# EAGLE design RAMPS_1.4.2.3 (EAGLE 7.5.0)
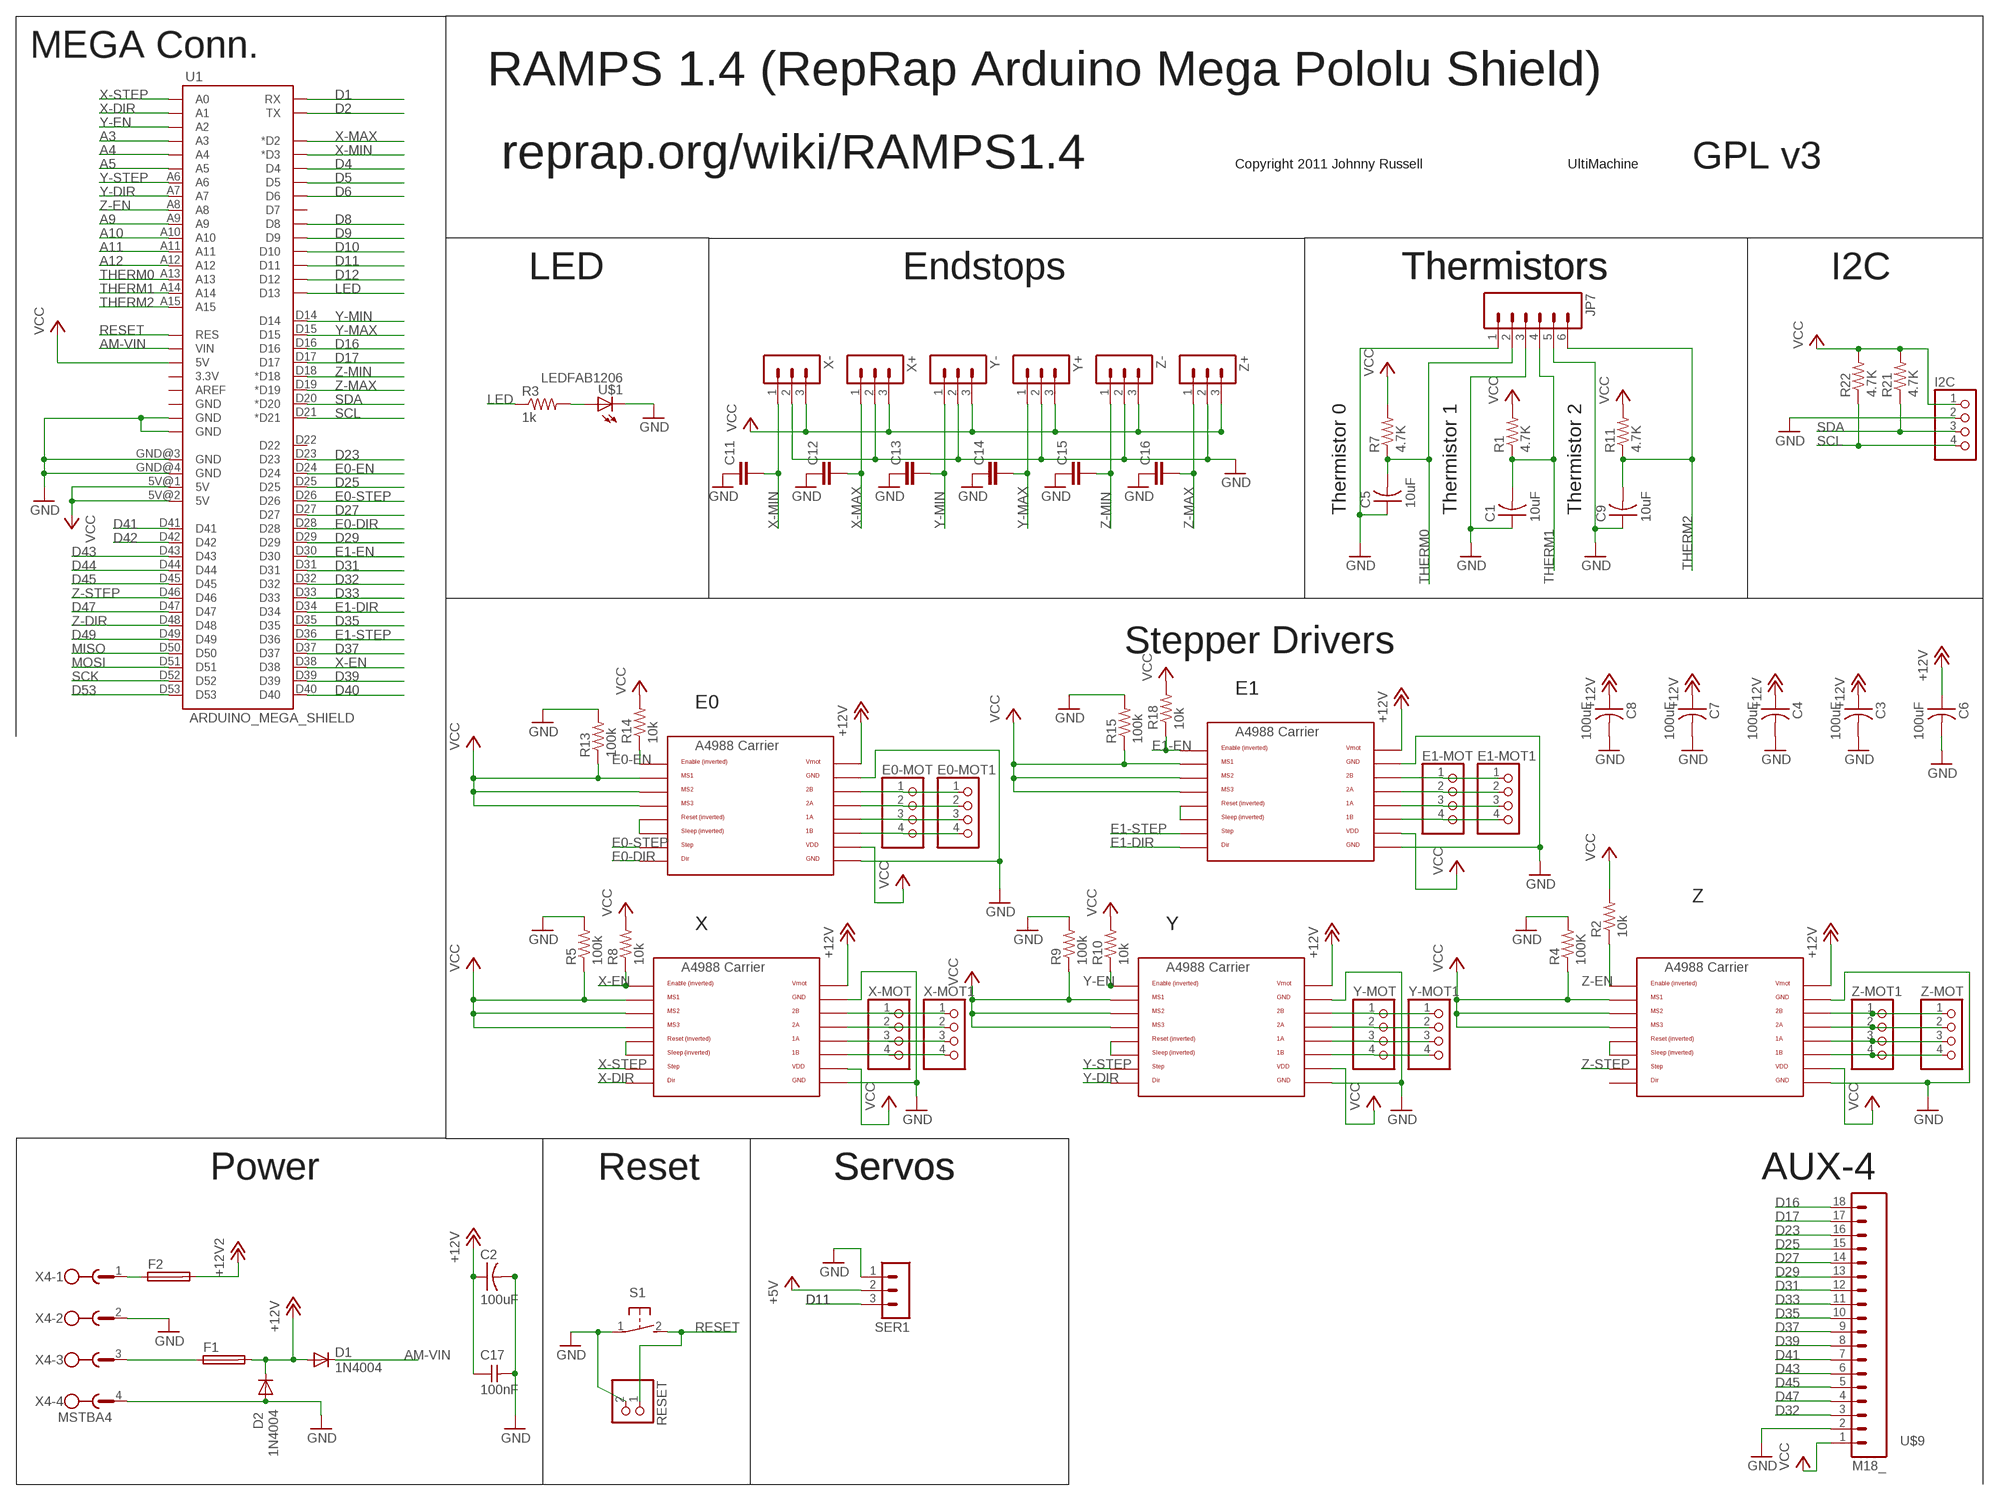
[diagram p0: schematic, sheet 1]

## Parts
C1  10uF  CAP-US1206FAB  [C1206FAB]
C2  100uF  CAP-US1206FAB  [C1206FAB]
C3  100uF  CAP-US1206FAB  [C1206FAB]
C4  100uF  CAP-US1206FAB  [C1206FAB]
C5  10uF  CAP-US1206FAB  [C1206FAB]
C6  100uF  CAP-US1206FAB  [C1206FAB]
C7  100uF  CAP-US1206FAB  [C1206FAB]
C8  100uF  CAP-US1206FAB  [C1206FAB]
C9  10uF  CAP-US1206FAB  [C1206FAB]
C11  C-EUC0805  [C0805]
C12  C-EUC0805  [C0805]
C13  C-EUC0805  [C0805]
C14  C-EUC0805  [C0805]
C15  C-EUC0805  [C0805]
C16  C-EUC0805  [C0805]
C17  100nF  CAP-UNPOLARIZEDFAB  [C1206FAB]
D1  1N4004  [DO41-10]
D2  1N4004  [DO41-10]
E0-MOT  PINHD-1X4  [1X04]
E0-MOT1  PINHD-1X4  [1X04]
E1-MOT  PINHD-1X4  [1X04]
E1-MOT1  PINHD-1X4  [1X04]
F1  FUSE_MCCQ-122  [FUSE_MCCQ-122]
F2  FUSE_MCCQ-122  [FUSE_MCCQ-122]
I2C  PINHD-1X4  [1X04]
JP7  M06SIP  [1X06]
R1  4.7K  R-US_R0805  [R0805]
R2  10k  RES-US1206FAB  [R1206FAB]
R3  1k  RES-US1206FAB  [R1206FAB]
R4  100K  RES-US1206FAB  [R1206FAB]
R5  100k  RES-US1206FAB  [R1206FAB]
R7  4.7K  R-US_R0805  [R0805]
R8  10k  RES-US1206FAB  [R1206FAB]
R9  100k  RES-US1206FAB  [R1206FAB]
R10  10k  RES-US1206FAB  [R1206FAB]
R11  4.7K  R-US_R0805  [R0805]
R13  100k  RES-US1206FAB  [R1206FAB]
R14  10k  RES-US1206FAB  [R1206FAB]
R15  100k  RES-US1206FAB  [R1206FAB]
R18  10k  RES-US1206FAB  [R1206FAB]
R21  4.7K  R-US_R0805  [R0805]
R22  4.7K  R-US_R0805  [R0805]
RESET  PINHD-2  [PINHD-2]
S1  31-XX  [B3F-31XX]
SER1  3PIN-HEADER  [3PIN-HEADER]
U1  ARDUINO_MEGA_SHIELD  [ARDUINO_MEGA_SHIELD]
U$1  LEDFAB1206  [LED1206FAB]
U$4  A4988BREAKOUT  [A4988BREAKOUT]
U$5  A4988BREAKOUT  [A4988BREAKOUT]
U$6  A4988BREAKOUT  [A4988BREAKOUT]
U$7  A4988BREAKOUT  [A4988BREAKOUT]
U$8  A4988BREAKOUT  [A4988BREAKOUT]
U$9  M18_  [1X18]
X4  MSTBA4  [MSTBA4]
X+  3PIN-HEADER  [3PIN-HEADER]
X-  3PIN-HEADER  [3PIN-HEADER]
X-MOT  PINHD-1X4  [1X04]
X-MOT1  PINHD-1X4  [1X04]
Y+  3PIN-HEADER  [3PIN-HEADER]
Y-  3PIN-HEADER  [3PIN-HEADER]
Y-MOT  PINHD-1X4  [1X04]
Y-MOT1  PINHD-1X4  [1X04]
Z+  3PIN-HEADER  [3PIN-HEADER]
Z-  3PIN-HEADER  [3PIN-HEADER]
Z-MOT  PINHD-1X4  [1X04]
Z-MOT1  PINHD-1X4  [1X04]

## Nets
+5V: SER1.2
+12V: C2.1 C3.1 C4.1 C6.1 C7.1 C8.1 C17.1 D1.A D2.C F1.2-1 F1.2-2 U$4.VMOT U$5.VMOT U$6.VMOT U$7.VMOT U$8.VMOT
+12V2: F2.2-1 F2.2-2
A3: U1.A3
A4: U1.A4
A5: U1.A5
A9: U1.A9
A10: U1.A10
A11: U1.A11
A12: U1.A12
AM-VIN: D1.C U1.VIN
D1: U1.RX
D2: U1.TX
D4: U1.D4
D5: U1.D5
D6: U1.D6
D8: U1.D8
D9: U1.D9
D10: U1.D10
D11: SER1.3 U1.D11
D12: U1.D12
D16: U1.D16 U$9.18
D17: U1.D17 U$9.17
D23: U1.D23 U$9.16
D25: U1.D25 U$9.15
D27: U1.D27 U$9.14
D29: U1.D29 U$9.13
D31: U1.D31 U$9.12
D32: U1.D32 U$9.3
D33: U1.D33 U$9.11
D35: U1.D35 U$9.10
D37: U1.D37 U$9.9
D39: U1.D39 U$9.8
D40: U1.D40
D41: U1.D41 U$9.7
D42: U1.D42
D43: U1.D43 U$9.6
D44: U1.D44
D45: U1.D45 U$9.5
D47: U1.D47 U$9.4
D49: U1.D49
D53: U1.D53
E0-DIR: U1.D28 U$4.DIR
E0-EN: R14.1 U1.D24 U$4.EN
E0-STEP: U1.D26 U$4.STEP
E1-DIR: U1.D34 U$5.DIR
E1-EN: R18.1 U1.D30 U$5.EN
E1-STEP: U1.D36 U$5.STEP
GND: C1.1 C2.2 C3.2 C4.2 C5.1 C6.2 C7.2 C8.2 C9.1 C11.1 C12.1 C13.1 C14.1 C15.1 C16.1 C17.2 D2.A I2C.2 JP7.1 JP7.3 JP7.5 R4.2 R5.2 R9.2 R13.2 R15.2 RESET.2 S1.1(P) SER1.1 U1.GND@0(GND) U1.GND@1(GND) U1.GND@3(GND) U1.GND@4(GND) U$1.2(C) U$4.GND U$4.GND@0(GND) U$5.GND U$5.GND@0(GND) U$6.GND U$6.GND@0(GND) U$7.GND U$7.GND@0(GND) U$8.GND U$8.GND@0(GND) U$9.2 X4.2 X4.4 X+.2 X-.2 Y+.2 Y-.2 Z+.2 Z-.2
LED: R3.1 U1.D13
MISO: U1.D50
MOSI: U1.D51
N$3: E0-MOT1.1 E0-MOT.1 U$4.2B
N$4: E0-MOT1.2 E0-MOT.2 U$4.2A
N$8: U$4.RST U$4.SLP(SLEEP)
N$10: E0-MOT1.3 E0-MOT.3 U$4.1A
N$11: E0-MOT1.4 E0-MOT.4 U$4.1B
N$12: E1-MOT1.1 E1-MOT.1 U$5.2B
N$13: E1-MOT1.2 E1-MOT.2 U$5.2A
N$16: E1-MOT1.3 E1-MOT.3 U$5.1A
N$18: E1-MOT1.4 E1-MOT.4 U$5.1B
N$20: U$6.RST U$6.SLP(SLEEP)
N$21: U$6.2B X-MOT1.1 X-MOT.1
N$22: U$6.2A X-MOT1.2 X-MOT.2
N$23: U$7.RST U$7.SLP(SLEEP)
N$24: U$5.RST U$5.SLP(SLEEP)
N$26: U$6.1A X-MOT1.3 X-MOT.3
N$27: U$6.1B X-MOT1.4 X-MOT.4
N$28: U$7.2B Y-MOT1.1 Y-MOT.1
N$29: U$7.2A Y-MOT1.2 Y-MOT.2
N$30: U$7.1A Y-MOT1.3 Y-MOT.3
N$36: U$7.1B Y-MOT1.4 Y-MOT.4
N$38: U$8.RST U$8.SLP(SLEEP)
N$41: U$8.2B Z-MOT1.1 Z-MOT.1
N$42: U$8.2A Z-MOT1.2 Z-MOT.2
N$43: U$8.1A Z-MOT1.3 Z-MOT.3
N$44: U$8.1B Z-MOT1.4 Z-MOT.4
N$46: R3.2 U$1.1(A)
N$53: F2.1-1 F2.1-2 X4.1
N$54: F1.1-1 F1.1-2 X4.3
RESET: RESET.1 S1.2(S) U1.RES
SCK: U1.D52
SCL: I2C.4 R22.1 U1.D21(*D21)
SDA: I2C.3 R21.1 U1.D20(*D20)
THERM0: C5.2 JP7.2 R7.1 U1.A13
THERM1: C1.2 JP7.4 R1.1 U1.A14
THERM2: C9.2 JP7.6 R11.1 U1.A15
VCC: I2C.1 R1.2 R2.2 R4.1 R5.1 R7.2 R8.2 R9.1 R10.2 R11.2 R13.1 R14.2 R15.1 R18.2 R21.2 R22.2 U1.5V@0(5V) U1.5V@1(5V) U1.5V@2(5V) U$4.MS1 U$4.MS2 U$4.MS3 U$4.VDD U$5.MS1 U$5.MS2 U$5.MS3 U$5.VDD U$6.MS1 U$6.MS2 U$6.MS3 U$6.VDD U$7.MS1 U$7.MS2 U$7.MS3 U$7.VDD U$8.MS1 U$8.MS2 U$8.MS3 U$8.VDD U$9.1 X+.3 X-.3 Y+.3 Y-.3 Z+.3 Z-.3
X-DIR: U1.A1 U$6.DIR
X-EN: R8.1 U1.D38 U$6.EN
X-MAX: C12.2 U1.D2(*D2) X+.1
X-MIN: C11.2 U1.D3(*D3) X-.1
X-STEP: U1.A0 U$6.STEP
Y-DIR: U1.A7 U$7.DIR
Y-EN: R10.1 U1.A2 U$7.EN
Y-MAX: C14.2 U1.D15 Y+.1
Y-MIN: C13.2 U1.D14 Y-.1
Y-STEP: U1.A6 U$7.STEP
Z-DIR: U1.D48
Z-EN: R2.1 U1.A8 U$8.EN
Z-MAX: C16.2 U1.D19(*D19) Z+.1
Z-MIN: C15.2 U1.D18(*D18) Z-.1
Z-STEP: U1.D46 U$8.STEP
Unconnected: U1.3.3V U1.AREF U1.D7 U1.D22 U1.GND@2(GND) U$8.DIR

## Notes on the sheet
- MEGA Conn.
- RAMPS 1.4 (RepRap Arduino Mega Pololu Shield)
- reprap.org/wiki/RAMPS1.4 | Copyright 2011 Johnny Russell | UltiMachine | GPL v3
- LED | Endstops | Thermistors | Thermistors | I2C
- Thermistor 0 | Thermistor 1 | Thermistor 2
- Stepper Drivers
- E1
- E0
- Z
- X | Y
- Power | Reset | Servos | Servos | AUX-4

## Library data of the parts
C1-C9 = fab:CAP-US
C11-C16 = rcl:C-EU: CAPACITOR, European symbol
C17 = fab:CAP-UNPOLARIZED
D1 D2 = diode:1N4004: DIODE general purpose rectifier, 1 A
E0-MOT E0-MOT1 E1-MOT E1-MOT1 I2C X-MOT X-MOT1 Y-MOT Y-MOT1 Z-MOT Z-MOT1 = RepRapjr:PINHD-1X4: PIN HEADER
F1 F2 = myLib:FUSE_MCCQ-122
JP7 = SparkFun:M06: Header 6 Standard 6-pin 0.1" header. Use with straight break away headers (SKU : PRT-00116), right angle break away headers (PRT-00553), swiss pins (PRT-00743), machine pins (PRT-00117), and female headers (PRT-00115). Molex polarized connector foot print use with SKU : PRT-08094 with associated crimp pins and housings. NOTES ON THE VARIANTS LOCK and LOCK_LONGPADS... This footprint was designed to help hold the alignment of a through-hole component (i.e. 6-pin header) while soldering it into place. You may notice that each hole has been shifted either up or down by 0.005 of an inch from it's more standard position (which is a perfectly straight line). This slight alteration caused the pins (the squares in the middle) to touch the edges of the holes. Because they are alternating, it causes a "brace" to hold the component in place. 0.005 has proven to be the perfect amount of "off-center" position when using our standard breakaway headers. Although looks a little odd when you look at the bare footprint, once you have a header in there, the alteration is very hard to notice. Also, if you push a header all the way into place, it is covered up entirely on the bottom side. This idea of altering the position of holes to aid alignment will be further integrated into the Sparkfun Library for other footprints. It can help hold any component with 3 or more connection pins.
R1 R7 R11 R21 R22 = adafruit:R-US_: RESISTOR, American symbol
R2-R5 R8-R10 R13-R15 R18 = fab:RES-US: Resistor (US Symbol) Variants with postfix FAB are widened to allow the routing of internal traces
RESET = myLib:PINHD-2
S1 = switch-omron:31-XX: OMRON SWITCH; MPN: B3F-3100; OC_FARNELL: 959704; OC_NEWARK: 36M3582
SER1 X+ X- Y+ Y- Z+ Z- = ultimachine:3PIN-HEADER: PIN HEADER
U1 = RepRapjr:ARDUINO_MEGA_SHIELD
U$1 = fab:LED: LED
U$4-U$8 = RepRapjr:A4988BREAKOUT
U$9 = SparkFun:M18
X4 = con-phoenix-508:MSTBA4: PHOENIX

## Board
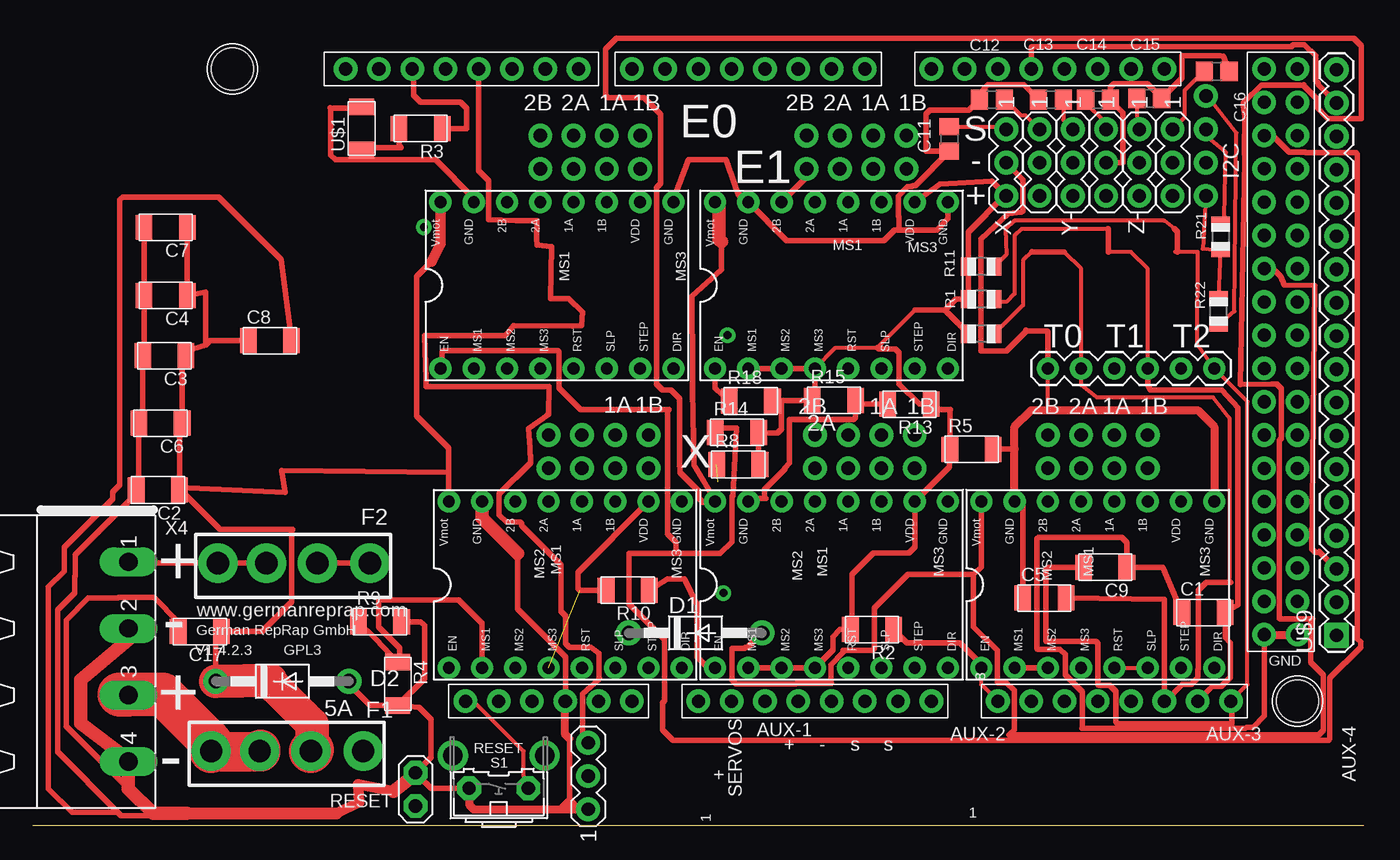
[diagram p1: board, top side]
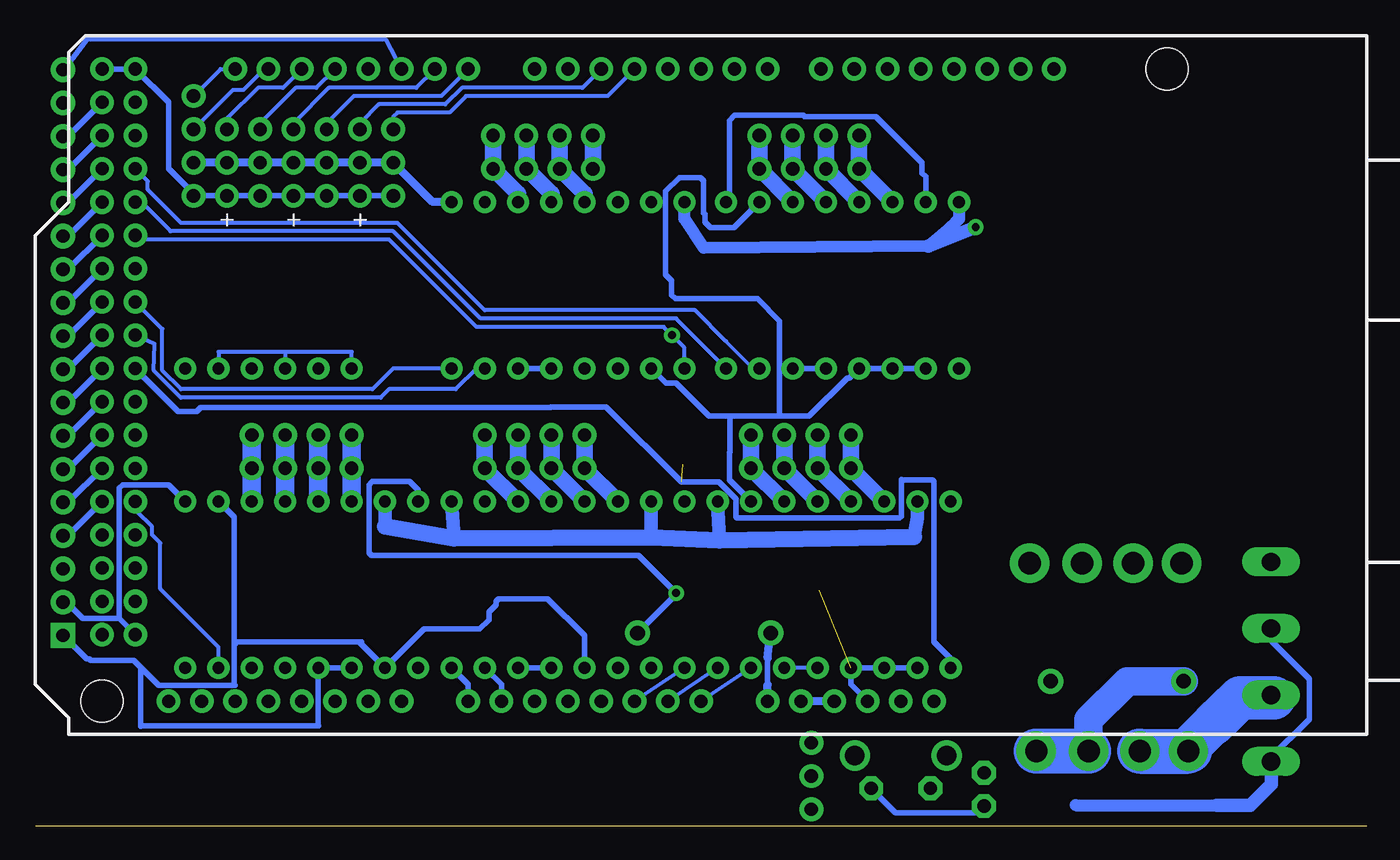
[diagram p2: board, bottom side, seen from below]

Size 101.59 x 0 mm. Coordinates in mm from the lower left corner, seen from the top.
Outline: 101.59,0 0,0
Copper layers (1*16): Top 0.035mm / dielectric 1.6mm / Bottom 0.035mm
Design rules "PCB-CART *": minimum track width 0.2mm, minimum drill 0.4mm, track to track 0.3mm, track to pad 0.3mm, pad to pad 0.2mm, via to via 0.2mm, smd to smd 0.2mm, copper to edge 0.2mm, drill to drill 0.2mm, minimum pad ring 0.4mm, minimum via ring 0.3mm, stop-mask expansion 3mil, vias tented up to drill 0.5mm, thermal gap 12mil

### Footprints (pad centres in the part's own frame; a part is rotated, then mirrored left to right if it is on the bottom)
C1206FAB = smd 1.27 x 1.905: 1 -1.651,0; 2 1.651,0
C0805 = smd 1.3 x 1.5: 1 -0.95,0; 2 0.95,0
DO41-10 = drill 1.118: A 5.08,0; C -5.08,0
1X04 = drill 1.016: 1 -2.54,0; 2 0,0; 3 2.54,0; 4 5.08,0
FUSE_MCCQ-122 = drill 1.7 pad 3: 1-1 -6.7,0; 1-2 -3,0; 2-1 4.9,0; 2-2 0.9,0
1X06 = drill 0.9 pad 1.422: 1 0,0; 2 2.54,0; 3 5.08,0; 4 7.62,0; 5 10.16,0; 6 12.7,0
R0805 = smd 1.1 x 1.4: 1 -1,0; 2 1,0
R1206FAB = smd 1.27 x 1.905: 1 -1.651,0; 2 1.651,0
PINHD-2 = drill 1.016 octagon: 1 -1.27,0; 2 1.27,0
B3F-31XX = drill 1.016 octagon: 1 -2.261,-1.245; 2 2.261,-1.245 | drill 1.499 pad 2.159: 3 -3.505,1.245; 4 3.505,1.245
3PIN-HEADER = drill 1.016: 1 -2.54,0; 2 0,0; 3 2.54,0
ARDUINO_MEGA_SHIELD = drill 1 pad 1.422: 3.3V 35.56,2.54; 5V@0 38.1,2.54; 5V@1 93.98,50.8; 5V@2 96.52,50.8; A0 50.8,2.54; A1 53.34,2.54; A2 55.88,2.54; A3 58.42,2.54; A4 60.96,2.54; A5 63.5,2.54; A6 66.04,2.54; A7 68.58,2.54; A8 73.66,2.54; A9 76.2,2.54; A10 78.74,2.54; A11 81.28,2.54; A12 83.82,2.54; A13 86.36,2.54; A14 88.9,2.54; A15 91.44,2.54; AREF 23.876,50.8; D2 58.42,50.8; D3 55.88,50.8; D4 53.34,50.8; D5 50.8,50.8; D6 48.26,50.8; D7 45.72,50.8; D8 41.656,50.8; D9 39.116,50.8; D10 36.576,50.8; D11 34.036,50.8; D12 31.496,50.8; D13 28.956,50.8; D14 68.58,50.8; D15 71.12,50.8; D16 73.66,50.8; D17 76.2,50.8; D18 78.74,50.8; D19 81.28,50.8; D20 83.82,50.8; D21 86.36,50.8; D22 93.98,48.26; D23 96.52,48.26; D24 93.98,45.72; D25 96.52,45.72; D26 93.98,43.18; D27 96.52,43.18; D28 93.98,40.64; D29 96.52,40.64; D30 93.98,38.1; D31 96.52,38.1; D32 93.98,35.56; D33 96.52,35.56; D34 93.98,33.02; D35 96.52,33.02; D36 93.98,30.48; D37 96.52,30.48; D38 93.98,27.94; D39 96.52,27.94; D40 93.98,25.4; D41 96.52,25.4; D42 93.98,22.86; D43 96.52,22.86; D44 93.98,20.32; D45 96.52,20.32; D46 93.98,17.78; D47 96.52,17.78; D48 93.98,15.24; D49 96.52,15.24; D50 93.98,12.7; D51 96.52,12.7; D52 93.98,10.16; D53 96.52,10.16; GND@0 40.64,2.54; GND@1 43.18,2.54; GND@2 26.416,50.8; GND@3 93.98,7.62; GND@4 96.52,7.62; RES 33.02,2.54; RX 63.5,50.8; TX 60.96,50.8; VIN 45.72,2.54 | hole 3.2: 96.52,2.54; 15.24,50.8
LED1206FAB = smd 1.27 x 1.905: 1 -1.651,0; 2 1.651,0
A4988BREAKOUT = drill 0.9: 1A 8.89,1.27; 1B 11.43,1.27; 2A 6.35,1.27; 2B 3.81,1.27; DIR 16.51,-11.43; EN -1.27,-11.43; GND 16.51,1.27; GND@0 1.27,1.27; MS1 1.27,-11.43; MS2 3.81,-11.43; MS3 6.35,-11.43; RST 8.89,-11.43; SLP 11.43,-11.43; STEP 13.97,-11.43; VDD 13.97,1.27; VMOT -1.27,1.27
1X18 = drill 1.016 pad 1.88 square: 1 0,0 | drill 1.016 pad 1.88: 2 2.54,0; 3 5.08,0; 4 7.62,0; 5 10.16,0; 6 12.7,0; 7 15.24,0; 8 17.78,0; 9 20.32,0; 10 22.86,0; 11 25.4,0; 12 27.94,0; 13 30.48,0; 14 33.02,0; 15 35.56,0; 16 38.1,0; 17 40.64,0; 18 43.18,0
MSTBA4 = drill 1.397 long: 1 -7.62,5.08; 2 -2.54,5.08; 3 2.54,5.08; 4 7.62,5.08

### Placement (x,y rotation side)
C1  89.35,16.3 0 top  (outside the outline)
C2  9.55,25.64 180 top  (outside the outline)
C3  10.05,35.89 180 top  (outside the outline)
C4  10.15,40.49 180 top  (outside the outline)
C5  77.2,17.39 0 top  (outside the outline)
C6  9.75,30.74 180 top  (outside the outline)
C7  10.15,45.7 180 top  (outside the outline)
C8  18.1,37.04 0 top  (outside the outline)
C9  81.85,19.74 180 top  (outside the outline)
C11  69.95,52.45 90 top  (outside the outline)
C12  73.2,55.45 0 top  (outside the outline)
C13  77.7,55.45 0 top  (outside the outline)
C14  81.3,55.45 180 top  (outside the outline)
C15  85.2,55.54 180 top  (outside the outline)
C16  90.35,57.59 180 top  (outside the outline)
C17  12.75,14.85 180 top  (outside the outline)
D1  50.57,14.73 0 top  (outside the outline)
D2  19.05,11.05 0 top  (outside the outline)
E0-MOT  41.27,52.7 0 top  (outside the outline)
E0-MOT1  41.27,50.16 0 top  (outside the outline)
E1-MOT  61.59,52.7 0 top  (outside the outline)
E1-MOT1  61.59,50.16 0 top  (outside the outline)
F1  20.32,5.71 0 top  (outside the outline)
F2  20.83,20.07 0 top  (outside the outline)
I2C  89.53,50.64 90 top  (outside the outline)
JP7  77.47,34.92 0 top  (outside the outline)
R1  72.39,40.22 180 top  (outside the outline)
R2  64.05,14.99 180 top  (outside the outline)
R3  29.6,53.24 180 top  (outside the outline)
R4  27.85,10.85 270 top  (outside the outline)
R5  71.65,28.74 0 top  (outside the outline)
R7  72.39,37.58 180 top  (outside the outline)
R8  53.85,27.59 0 top  (outside the outline)
R9  26.5,15.6 0 top  (outside the outline)
R10  45.4,17.99 180 top  (outside the outline)
R11  72.39,42.7 180 top  (outside the outline)
R13  66.9,32.2 180 top  (outside the outline)
R14  53.75,30.04 0 top  (outside the outline)
R15  61.15,32.49 0 top  (outside the outline)
R18  54.8,32.45 0 top  (outside the outline)
R21  90.64,44.96 270 top  (outside the outline)
R22  90.49,39.28 90 top  (outside the outline)
RESET  29.21,2.79 90 top
S1  35.56,4.13 0 top
SER1  42.39,3.81 90 top
U1  0,6.98 0 top  (outside the outline)
U$1  25.1,53.24 90 top  (outside the outline)
U$4  32.38,46.35 0 top  (outside the outline)
U$5  53.34,46.35 0 top  (outside the outline)
U$6  33.02,23.49 0 top  (outside the outline)
U$7  53.34,23.49 0 top  (outside the outline)
U$8  73.66,23.49 0 top  (outside the outline)
U$9  99.5,14.54 90 top  (outside the outline)
X4  2.22,12.54 270 top  (outside the outline)
X+  76.83,50.64 270 top  (outside the outline)
X-  74.3,50.64 270 top  (outside the outline)
X-MOT  41.91,29.84 0 top  (outside the outline)
X-MOT1  41.91,27.3 0 top  (outside the outline)
Y+  81.92,50.64 270 top  (outside the outline)
Y-  79.38,50.64 270 top  (outside the outline)
Y-MOT  62.23,29.84 0 top  (outside the outline)
Y-MOT1  62.23,27.3 0 top  (outside the outline)
Z+  87,50.64 270 top  (outside the outline)
Z-  84.45,50.64 270 top  (outside the outline)
Z-MOT  80.01,29.84 0 top  (outside the outline)
Z-MOT1  80.01,27.3 0 top  (outside the outline)

### Tracks (layer width: path | path; a pad name or v marks a point on that pad's centre or on a via)
+12V  (via drill 0.6)
  Top 0.406: 31.75,26.99 31.75,28.84 29.3,31.29 29.3,41.93 30.44,43.07 | 31.75,26.99 U$6.VMOT 31.59,24.6 | U$7.VMOT 52.1,24.79 50.45,27.54 50.35,33.29 50.35,34.7 50.3,40.45 52.55,42.49 52.55,44.61 | D2.C 13.97,14.41 C17.1 17.5,14.85 19.75,17.09 19.75,22.55 19.85,22.64 14.3,22.64 11.1,25.84 | D1.A 54.56,13.64 54.4,13.64 54.3,13.54 53.35,13.54 53.35,11.14 53.65,10.85 58.25,10.85 58.3,10.89 60.95,10.89 60.9,10.94 60.9,12.29 61.85,13.24 61.85,13.39 64.1,13.39 64.25,13.54 64.25,16.64 66.8,19.2 71.8,19.2 | 71.8,19.2 72.39,19.78 U$8.VMOT | 11.1,25.84 C2.1 11.2,30.54 C6.1 11.4,31.64 11.4,35.59 C3.1 11.7,36.25 13.2,36.7 | 11.1,25.84 19.25,25.45 19,27.14 31.75,26.99 | C7.1 C4.1 13.2,40.75 13.2,36.7 | 13.2,36.7 13.55,37.04 C8.1 | 51.91,24.6 51.82,24.7 51.15,24.7 50.85,24.99 50.85,25.54 49.4,26.99 49.4,27.45 49.35,27.49 49.35,32.64 48.7,33.29 48.05,33.29 47.6,33.74 47.6,48.74 47.9,49.04 47.9,54.34 46.65,55.59 43.9,55.59 43.7,55.79 43.7,59.29 44.55,60.15 100.8,60.15 101.4,59.54 101.4,53.99 98.85,53.99 97.95,54.89 97.95,55.54 97,56.49 97,56.59 96.95,56.54 93.75,56.54 92.4,55.2 92.4,54.99 92.5,54.2 92.45,51.49 92.5,50.84 92.15,33.7 94.55,33.74 94.95,33.74 95.3,33.39 95.3,29.59 95.15,29.45 95.15,15.85 95.2,15.79 97.7,15.79 97.55,15.64 97.55,12.49 98.5,11.54 98.5,7.29 98.15,6.94 74.5,6.94 74.9,7.34 74.9,10.35 74.3,10.94 73.65,10.94 73.6,10.99 73.6,13.39 71.8,15.19 71.8,19.2
  Top 0.813: 30.44,43.07 31.11,44.45 U$4.VMOT
  Top 1.016: U$7.VMOT 51.91,24.6 | U$8.VMOT 72.23,24.6 | 52.55,44.61 52.39,44.77 52.39,47.31 U$5.VMOT
  Top 2.54: D2.C 18.14,11.1 18.54,10.54 21.34,7.75 21.34,5.83
  Top 3.302: 21.34,5.83 F1.2-2
  Bottom 0.406: D1.A 52.7,17.68 v52.7,17.78 55.57,20.64 75.95,20.64 76.15,20.84 76.15,26.04 75.9,26.29 73.05,26.29 72.39,25.63 U$8.VMOT
  Bottom 0.914: U$4.VMOT 31.11,46.35 31.75,45.72 33.44,44.27 50.59,44.12 52.07,46.35 U$5.VMOT
  Bottom 1.016: 33.44,44.27 v29.84,45.72
  Bottom 1.27: U$6.VMOT
  Bottom 2.184: F1.2-2 21.25,8.09 18.29,11.05 D2.C
  Bottom 3.429: F1.2-2 F1.2-1
  pour Top: 51.44,24.13 51.44,23.49 52.07,24.77
+12V2
  Top 0.406: F2.2-2 F2.2-1
AM-VIN
  Bottom 0.406: 45.72,10.79 45.72,12.81
  Bottom 0.61: 45.72,12.81 D1.C | U1.VIN 45.72,10.79
D11
  Top 0.406: SER1.3 41.95,6.79 41.95,10.1 43.25,11.24 43.2,11.39 43.2,13.19 42.6,13.64 40.95,13.64 40.65,13.94 40.65,16.05 40.3,16.39 40.3,19.95 37.3,22.95 37.3,23.09 37.2,23.2 36.15,23.2 35.6,23.74 35.6,25.34 38,27.7 37.95,28.84 | 38,27.89 37.95,28.84 | 37.95,28.84 37.85,30.34 39.35,31.39 | 39.2,31.34 39.35,31.39 | 39.35,31.39 39.4,33.54 30,33.54 30,34.09 29.9,37.45 36.1,37.45 36.7,38.2 41.2,38.14 41.9,38.2 41.95,39.24 40.9,40.24 39.5,40.24 39.6,44.24 38.5,44.34 38.45,44.84 38.5,46.2 36.9,46.2 34.8,46.29 34.8,49.24 34.04,50.01 U1.D11
D16
  Bottom 0.305: 97.69,60.01 74.83,60.01 U1.D16
  Bottom 0.406: U$9.18 98.62,58.8 97.69,60.01
D17
  Top 0.406: U$9.17 98.1,56.59 98.1,56.7 97.9,56.9 97.9,58.79 97.05,59.65 96.2,59.65 96.05,59.49 76.25,59.49 76.2,59.45 U1.D17
D23
  Bottom 0.406: U1.D23 99.07,52.7 U$9.16
D25
  Bottom 0.406: U1.D25 99.07,50.15 U$9.15
D27
  Bottom 0.406: U1.D27 99.07,47.61 U$9.14
D29
  Bottom 0.406: U1.D29 99.07,45.07 U$9.13
D31
  Bottom 0.406: U1.D31 99.07,42.53 U$9.12
D32
  Top 0.406: U$9.3 98.24,20.88 | 98.24,20.88 98.18,20.95 | U1.D32 94.65,42.54 95.25,41.95 95.5,41.29 97.85,41.24 97.6,21.14 97.86,20.88 98.24,20.88
D33
  Bottom 0.406: U1.D33 99.07,39.99 U$9.11
D35
  Bottom 0.406: U1.D35 99.07,37.45 U$9.10
D37
  Bottom 0.406: U1.D37 99.07,34.91 U$9.9
D39
  Bottom 0.406: U1.D39 99.07,32.38 U$9.8
D41
  Bottom 0.406: U1.D41 99.07,29.84 U$9.7
D43
  Bottom 0.406: U1.D43 99.07,27.29 U$9.6
D45
  Bottom 0.406: U1.D45 99.07,24.75 U$9.5
D47
  Bottom 0.406: U1.D47 99.07,22.21 U$9.4
E0-DIR
  Bottom 0.305: U1.D28 93.5,47.62 91.28,45.4 74.3,45.4 67.63,38.73 52.7,38.73 U$4.DIR
E0-EN
  Top 0.406: 49.1,20.8 52.45,20.8 53.35,21.7 53.35,25.14 53.45,25.24 53.7,30.39 52.45,30.39 R14.1 | 49.1,20.8 45.5,20.8 45.5,16.95 48.2,14.24 48.2,9.54 48.05,9.39 48.05,7.34 48.85,6.54 98.9,6.54 99,6.64 99,11.29 101.35,13.64 101.35,14.04 101.1,14.29 101.1,51.29 101,51.39 97.15,51.39 97.1,51.45 95.9,51.45 94.64,52.7 U1.D24 | U$4.EN 31.25,35.06 31.25,36.2 31.35,36.29 40.05,36.29 40.15,36.2 40.15,33.45 41.8,31.79 48.55,31.79 48.45,31.7 48.45,22.3 49.1,21.64 49.1,20.8
E0-STEP
  Bottom 0.254: 48.9,36.99 46.83,34.92 U$4.STEP
  Bottom 0.305: U1.D26 93.03,49.21 93.03,48.58 90.49,46.04 73.98,46.04 67.31,39.37 51.28,39.37 48.9,36.99
E1-DIR
  Bottom 0.305: U1.D34 91.92,37.94 91.92,34.77 90.49,33.34 75.88,33.34 74.3,34.92 U$5.DIR
E1-EN  (via drill 0.6)
  Top 0.406: R18.1 52.07,33.42 U$5.EN
  Bottom 0.305: U1.D30 93.66,44.77 74.61,44.77 67.94,38.1 53.66,38.1 v53.02,37.46 52.07,36.51 U$5.EN
E1-STEP
  Bottom 0.305: U1.D36 92.51,36.79 92.56,34.75 90.51,32.7 75.25,32.7 74.61,33.34 69.53,33.34 67.94,34.92 U$5.STEP
GND
  Top 0.305: 77.47,31.75 JP7.1
  Top 0.406: 40.96,1.9 40.96,6.67 | 22.7,54.84 22.75,54.79 | 22.75,54.79 22.75,51.2 23.1,50.84 30.75,50.84 33.66,47.94 U$4.GND@0 | 29.12,3.86 RESET.2 | RESET.2 30.39,2.88 S1.1 | U1.GND@0 40.65,12.89 36.99,16.55 36.99,20.8 | C16.1 90.85,58.74 90.6,58.79 87.7,58.79 87.7,57.09 C15.1 85.05,56.65 82.5,56.65 82.25,56.4 C14.1 83.2,54.45 83.2,50.64 Y+.2 | C13.1 75.65,56.59 72.9,56.59 72.25,55.9 C12.1 71.45,54.64 68.45,54.64 68.15,54.34 68.15,51.49 C11.1 67.35,48.89 67.2,48.89 67.15,48.84 67.1,48.84 67.05,48.79 66.75,48.79 66.05,48.09 66.05,46.54 66.1,46.49 66.1,45.49 | X-.2 75.55,49.34 75.55,46.95 75.45,46.84 74.45,46.74 72.35,44.79 72.35,36.29 72.4,36.24 74.3,36.24 75.8,37.74 75.8,37.84 75.85,37.79 77.4,37.79 77.47,37.72 JP7.1 | U$4.GND 48.9,47.84 50.05,50.84 52.9,50.84 53.85,48.14 54.09,48.14 U$5.GND@0 57.54,44.7 64.95,44.7 65.75,45.49 66.1,45.49 | U$1.2 25,54.79 22.75,54.79 | C17.2 11.1,15.6 9.25,17.45 6.55,17.45 6.5,17.39 4.25,17.39 2.55,15.69 2.55,7.61 9.21,0.95 9.05,0.79 6.75,0.79 6.5,1.04 | R5.2 73.55,28.79 74.93,28.79 | R4.2 29.9,11.24 29.9,15.29 29.6,15.6 R9.2 | RESET.2 30.4,5.25 30.4,8.14 29.5,9.04 R4.2 | C5.1 75.58,24.77 U$8.GND@0 | C1.1 86.25,19.74 C9.1 83.5,21.64 83.1,22.05 76.75,22.05 76.65,21.95 76.65,13.54 76.7,13.49 78.4,13.49 78.8,13.1 78.8,11.54 80.1,10.24 80.1,7.49 80.05,7.44 92.55,7.44 92.65,7.54 93.15,7.54 94,8.39 94,14.58 U1.GND@3 | 6.5,1.04 1.9,5.64 1.9,16.49 3.2,17.8 3.2,19.05 3.25,19.09 3.25,20.7 7.75,25.19 C2.2 8.1,26.14 C6.2 8.4,31.04 C3.2 8.5,35.99 C4.2 C7.2 | R4.2 25.75,9.19 24.13,10.81 D2.A | 66.1,45.49 69,45.49 69.85,46.34 U$5.GND
  Top 0.406: R13.2 63,32.2 R15.2 62.8,31.2 62.65,31.04 57.75,31.04 57.75,27.7 57.4,27.34 57.4,27.24 55.85,25.7 55.85,25.09 55.95,24.99 54.84,24.99 U$7.GND@0 | 6.5,1.04 3,1.04 1.2,2.84 1.2,18.24 2.4,19.45 2.4,21.24 6.1,24.95 6.1,25.49 6.65,26.04 6.65,47.79 6.85,47.99 14.2,47.99 18.95,43.24 C8.2
  Top 0.61: U1.GND@3 U1.GND@4 | U$8.GND 90.17,30.48 88.9,31.75 77.47,31.75 76.2,31.75 74.93,30.48 74.93,28.79 U$8.GND@0 | S1.1 33.3,1.63 33.66,1.27 40.32,1.27 | 40.96,1.27 40.96,1.9 | 40.96,6.67 40.64,6.98 U1.GND@0 | 40.32,1.27 40.96,1.27 | 40.96,1.27 41.59,1.27 | 41.59,1.27 SER1.1 | SER1.1 | 40.32,1.27 40.96,1.9 | 40.96,1.9 41.59,1.27
  Top 0.813: 23.18,0.95 24.92,1.79 24.85,3.16 27.55,2.64
  Top 0.914: 11.75,0.95 23.18,0.95
  Top 1.016: 11.75,0.95 9.21,0.95 7.3,2.86 7.3,5.08 3.65,7.83 3.65,11.14 7.3,14.2 X4.2 | U$6.GND@0 34.29,23.49 36.99,20.8 | 27.55,2.64 29.12,3.86
  Bottom 0.305: 77.47,35.24 JP7.1 77.47,36.2 82.55,36.2 | 82.55,36.2 JP7.3 | 82.55,36.2 87.63,36.2 JP7.5 | Z+.2
  Bottom 0.406: 7.46,5.08 4.4,8.14 4.4,11.24 7.22,14.07 7.22,14.12 7.3,14.2 X4.2 | U1.GND@3 95.22,15.85 | 95.22,15.85 98,15.85 99.09,16.94 U$9.2 | U$8.GND 91.45,26.04 94.95,26.04 95.2,25.79 95.2,22.84 95.22,22.82 95.22,15.85 | U$4.GND 48.65,47.87 48.65,53.84 48.25,54.24 43,54.24 42.9,54.14 37.45,54.14 33.95,50.64 33.95,49.84 33.66,49.55 U$4.GND@0
  Bottom 0.61: I2C.2 Z+.2 Z-.2 Y+.2 Y-.2 X+.2 X-.2 71.28,47.62 U$5.GND | U1.GND@0 U1.GND@1
  Bottom 0.914: 22.23,1.59 11.43,1.59 | 7.62,5.08 7.46,5.08 X4.4 | U$6.GND@0
  Bottom 1.016: 74.93,22.86 U$8.GND@0 | 69.65,21.96 U$7.GND | 54.61,22.01 U$7.GND@0 | U$6.GND | 49.38,21.81 U$6.GND | U$6.GND@0 34.29,23.49 34.58,22.06 | 11.43,1.59 8.89,1.59 7.3,3.17 X4.4
  Bottom 1.27: 34.58,22.06 49.38,21.81 54.61,22.01 69.65,21.96 74.93,22.86
LED
  Top 0.406: U1.D13 29.05,57.69 29.05,55.79 29.6,55.24 32.65,55.24 33.1,54.79 33.1,53.24 R3.1
N$3
  Bottom 1.27: U$4.2B E0-MOT1.1 E0-MOT.1 | E0-MOT.1
N$4
  Bottom 1.27: U$4.2A E0-MOT1.2 E0-MOT.2 | E0-MOT.2
N$8
  Bottom 0.406: U$4.RST U$4.SLP
N$10
  Bottom 1.27: U$4.1A E0-MOT1.3 E0-MOT.3 | E0-MOT.3
N$11
  Bottom 1.27: U$4.1B E0-MOT1.4 E0-MOT.4 | E0-MOT.4
N$12
  Top 0.406: U$5.2B 59.05,49.53 E1-MOT1.1
  Bottom 1.27: E1-MOT1.1 E1-MOT.1
N$13
  Bottom 1.27: U$5.2A 59.69,48.26 E1-MOT1.2 E1-MOT.2
N$16
  Bottom 1.27: U$5.1A 62.23,48.26 E1-MOT1.3 E1-MOT.3
N$18
  Bottom 1.27: U$5.1B 64.77,48.26 E1-MOT1.4 E1-MOT.4
N$20
  Bottom 0.305: U$6.RST U$6.SLP
N$21
  Bottom 1.27: U$6.2B | U$6.2B X-MOT1.1 X-MOT.1
N$22
  Bottom 1.27: U$6.2A | U$6.2A X-MOT1.2 X-MOT.2
N$23
  Bottom 0.406: U$7.RST U$7.SLP
N$24
  Bottom 0.406: U$5.RST U$5.SLP
N$26
  Bottom 1.27: U$6.1A | U$6.1A X-MOT1.3 X-MOT.3
N$27
  Bottom 1.27: U$6.1B | U$6.1B X-MOT1.4 X-MOT.4
N$28
  Bottom 1.27: U$7.2B Y-MOT1.1 Y-MOT.1
N$29
  Bottom 1.27: U$7.2A Y-MOT1.2 Y-MOT.2
N$30
  Bottom 1.27: U$7.1A Y-MOT1.3 Y-MOT.3
N$36
  Bottom 1.27: U$7.1B Y-MOT1.4 Y-MOT.4
N$38
  Top 0.305: U$8.RST U$8.SLP
N$41
  Bottom 1.422: U$8.2B Z-MOT1.1 Z-MOT.1
N$42
  Bottom 1.422: U$8.2A Z-MOT1.2 Z-MOT.2
N$43
  Bottom 1.422: U$8.1A Z-MOT1.3 Z-MOT.3
N$44
  Bottom 1.422: U$8.1B Z-MOT1.4 Z-MOT.4
N$46
  Top 0.406: U$1.1 25.3,51.79 28.1,51.79 27.95,51.95 R3.2
N$53
  Top 0.406: X4.1 7.4,20.07 F2.1-1 F2.1-2
N$54
  Top 0.305: 13.46,6.17 13.46,6.48 13.3,6.64 | 13.57,5.67 16.5,5.67 | 13.46,6.17 13.46,5.67 13.57,5.67 | 13.46,6.17 9.6,10.03 | 13.57,5.67 F1.1-1 | 13.57,5.67 17.27,5.67 F1.1-2
  Top 3: 17.4,5.84 17.4,5.67 16.5,5.67 13.46,5.67
  Top 3.302: F1.1-1 13.62,6.32 13.3,6.64 9.91,10.03 9.6,10.03 6.6,10.03 6.64,10 X4.3
  Bottom 0.305: 13.46,5.67 13.57,5.67 F1.1-1
  Bottom 3.21: 11.72,7.78 11.76,7.78 13.4,6.14 13.4,5.73 13.46,5.67 13.8,5.67
  Bottom 3.302: 11.72,7.78 9.65,9.78 7.11,9.78
  Bottom 3.429: F1.1-2 F1.1-1
RESET
  Top 0.305: S1.2 37.82,3.45 37.47,3.81 37.47,5.71 33.66,9.53 U1.RES
  Bottom 0.406: RESET.1 29.72,1.02 35.95,1.02 S1.2
SCL
  Top 0.305: R22.1 91.71,39.3 91.86,52.9 89.69,55.72 I2C.4
  Bottom 0.305: I2C.4 87.47,57.79 U1.D21
SDA
  Top 0.305: R21.1 90.94,46.18 90.95,46.52 91.06,51.43 89.53,52.7 I2C.3
  Bottom 0.305: I2C.3 86.52,56.2 85.72,56.2 84.14,57.79 U1.D20
THERM0
  Top 0.305: 91.34,18.57 91.34,31.11 90.09,32.71 81.2,32.71 80.01,33.65 JP7.2 80.01,42.54 78.74,43.81 | R7.1 75.56,39.75 75.56,43.18 76.25,43.86
  Top 0.406: C5.2 86.36,17.29 U1.A13 86.48,9.53 87.75,10.79 88.4,10.79 88.9,11.29 88.9,11.94 88.95,11.99 88.95,17.99 89.55,18.59 91.42,18.59 91.34,18.57 | 76.25,43.86 76.3,43.81 78.74,43.81
THERM1
  Top 0.305: 82.09,43.81 83.82,43.81 85.09,42.54 JP7.4 | R1.1 73.6,40 74.3,40 74.93,40.64 74.93,45.09 75.47,45.57 81.81,45.57 82.04,45.59
  Top 0.406: 82.04,45.59 82.09,45.55 82.09,43.81 | U1.A14 90.02,10.64 90.7,10.64 91.4,11.35 91.4,13.99 91,14.39 C1.2 91.95,16.89 91.95,31.95 90.75,33.29 85.3,33.29 85.09,33.7 JP7.4
THERM2
  Top 0.305: U1.A15 92.71,10.79 92.71,32.38 JP7.6 | JP7.6 90.01,35.08 | 87.17,43.81 87.35,43.81 88.9,43.81 88.87,36.79 JP7.6 | R11.1 74.3,43.61 74.25,45.57 74.93,46.2 86.36,46.2 87.12,45.59
  Top 0.406: U1.A15 91.5,9.46 91.5,7.69 91.4,7.79 82.8,7.79 82.65,7.94 82.65,10.29 82.2,10.74 81.35,10.74 81.3,10.79 81.3,13.94 81.15,14.1 77.35,14.1 77.3,14.14 77.3,19.59 77.45,19.74 C9.2 | 87.12,45.59 87.35,45.36 87.35,43.81
VCC  (1 unrouted)
  Top 0.305: R22.2 R21.2 89.28,44.07 I2C.1 | 67.31,39.37 64.45,36.51 61.28,36.51 U$5.MS3
  Top 0.406: U$5.VDD 69.25,49.01 73.18,49.21 X-.3 74.16,48.1 71.4,45.34 R11.2 R1.2 70.44,40.22 69.6,39.37 | U$7.MS1 U$7.MS2 U$7.MS3 61.05,13.42 61.05,14.44 61.6,14.99 R2.2 62.5,15.1 62.5,19.2 64.15,20.84 66.85,20.84 67.31,21.3 U$7.VDD 69.95,27.4 R5.1 70,31.74 70.05,31.79 68.95,31.79 R13.1 67.65,32.2 66.1,33.74 66.1,36.14 65.85,36.39 64.57,36.39 64.45,36.51 | R9.1 26.2,14.24 R4.1 28,12.65 28,13.6 26.4,15.19 26.4,17.2 26.45,17.24 32.5,17.24 34.29,15.46 U$6.MS1 | U$8.MS2 U$8.MS1 | U$5.MS1 U$5.MS2 U$5.MS3 59.69,32.69 R15.1 57.2,32.49 57.15,32.45 | R7.2 69.6,39.37 | 69.6,39.37 67.31,39.37 | R8.2 55.4,27.7 R14.2 55.45,29.99 56.85,29.99 57.15,30.29 57.15,32.45 | 57.15,32.45 R18.2 | U$6.VDD 41.6,19.38 41.6,18.14 41.75,17.99 R10.2
  Bottom 0.305: X-.3 74.3,47.78 | I2C.1
  Bottom 0.406: I2C.1 Z+.3 Z-.3 Y+.3 Y-.3 X+.3 X-.3 | U1.5V@2 U1.5V@1 91.44,55.24 91.44,50.16 89.53,48.26 | U$4.MS1 U$4.MS2 U$4.MS3 39.47,34.2 39.65,34.2 42.55,31.29 44.8,31.29 | U$9.1 97.7,12.74 97.5,12.74 97.4,12.64 94.1,12.64 93.55,12.1 | 93.55,12.1 93.55,7.59 93.5,7.64 80,7.64 80.01,7.65 U$8.MS3 U$8.MS2 | U$7.MS3 59.69,14.53 62.5,17.34 66.25,17.34 66.45,17.14 66.45,16.89 67,16.34 67,15.74 67.7,15.04 71.95,15.04 U$8.MS1 76.9,14.03 76.9,14.04 | U$6.VDD 48.65,26.42 48.65,28.49 48.6,28.54 48.6,31.29 | 44.8,31.29 48.6,31.29 | U$4.VDD 48.28,45.7 50.1,45.7 50.5,46.09 50.5,46.7 50.6,46.79 50.6,49.24 50.85,49.49 52.45,49.49 53.5,48.45 53.5,42.09 53.05,41.64 53.05,40.54 52.75,40.24 46.5,40.24 44.8,38.54 44.8,31.29 | U$5.MS1 53.48,33.79 52.7,33.79 50.2,31.29 48.6,31.29 | U1.5V@0 39.37,10.79 U$6.MS3 U$6.MS2 U$6.MS1 | 93.55,12.1 92.2,10.74 86.35,10.74 86.45,10.85 86.45,13.79 | 86.45,13.79 86.2,14.04 76.9,14.04 | 76.9,14.04 76.7,14.04 | U$8.VDD 86.45,23.59 86.45,13.79
  Bottom 0.61: I2C.1 89.53,48.26
X-DIR
  Bottom 0.305: U$6.DIR U1.A1
X-EN  (1 unrouted)
  Bottom 0.406: U1.D38 90.7,31.64 89.3,31.64 89,31.95 62.3,31.95 62.25,31.99 58.05,31.99 52.3,26.24 49.45,26.24 48.15,24.95 48.15,23.59 48.05,23.49 35.65,23.49 35.5,23.64 35.5,26.45 35.45,26.39 33.15,26.39 33.05,26.29 33.05,14.04 31.75,12.74 U$6.EN
X-MAX
  Top 0.305: C12.2 74.2,55.45 75.4,54.24 75.77,54.24 X+.1
  Bottom 0.305: X+.1 76.83,53.66 75.41,55.09 70.33,55.09 69.06,56.36 59.85,56.36 U1.D2
X-MIN
  Top 0.305: C11.2 74.08,53.39 X-.1
  Bottom 0.305: X-.1 74.3,54.13 73.98,54.45 70.01,54.45 68.74,55.72 57.94,55.72 U1.D3
X-STEP
  Bottom 0.305: U$6.STEP U1.A0
Y-DIR
  Bottom 0.305: U1.A7
  Bottom 0.406: U1.A7 68.58,10.79 U$7.DIR
Y-EN
  Top 0.406: R10.1 48.45,18.84 49.75,18.84 50.7,16.89 50.7,12.89 51.53,12.06 U$7.EN
  Bottom 0.305: U$7.EN U1.A2
Y-MAX
  Top 0.305: C14.2 80.35,55.22 81.81,53.76 81.81,53.28 Y+.1
  Bottom 0.305: Y+.1 81.92,53.66 79.22,56.36 72.55,56.36 U1.D15
Y-MIN
  Top 0.305: C13.2 78.65,53.91 Y-.1
  Bottom 0.305: Y-.1 79.38,53.66 77.31,55.72 70.64,55.72 U1.D14
Y-STEP
  Bottom 0.305: U1.A6
  Bottom 0.406: U1.A6 66.04,10.79 U$7.STEP
Z-EN
  Top 0.305: U1.A8 72.39,10.79 U$8.EN
  Top 0.406: R2.1 66.7,13.99 70.75,13.99 72.39,12.35 U$8.EN
Z-MAX
  Top 0.305: C16.2 88.85,57.09 87.9,56.15 87.9,54.09 Z+.1
  Bottom 0.305: Z+.1 87,53.97 84.61,56.36 82.71,56.36 U1.D19
Z-MIN
  Top 0.305: C15.2 84.25,53.39 Z-.1
  Bottom 0.305: Z-.1 84.45,53.66 81.76,56.36 80.17,56.36 U1.D18
Z-STEP
  Bottom 0.305: U$8.STEP 87.63,13.65 92.08,18.1 92.08,21.59 92.71,22.23 92.71,22.86 93.82,23.97 93.82,24.61 U1.D46
(copper drawn outside any net)
  shapes: Bottom circle x1

### Text on the board
tNames: 2B | 2A | 1A | 1B | 2B | 2A | 1A | 1B | E0 | S | - | E1 | + | MS1 | MS3 | MS1 | MS3 | T0 | T1 | T2 | 1A | 1B | 2B | 2A | 1A | 1B | 2B | 2A | 1A | 1B | X | + | MS2 | MS1 | MS3 | MS2 | MS1 | MS3 | MS2 | MS1 | MS3 | www.germanreprap.com | German RepRap GmbH | - | V1.4.2.3 | GPL3 | GND | 8 | + | 5A | AUX-1 | AUX-2 | AUX-3 | RESET | + | - | s | s | - | + | AUX-4 | SERVOS | 1 | 1
bNames: + | + | + | +
Document: RAMPS 1.4.2.1 (RepRap Arduino MEGA Pololu Shield) | GPL v3 | reprap.org/wiki/RAMPS1.4 | Reversing input power, and inserting stepper drivers incorrectly will destroy electronics. | I2C | 21 | 20 | 12-35V Out | GND | 5V | - | D10 | + | AUX-4 | D16 | - | D17 | D9 | + | D23 | D25 | - | D11 | D27 | + | D29 | D31 | 12-35VDC In | D33 | + | D35 | 11A | D37 | - | D38 | D41 | + | 5A | D43 | - | D45 | SERVOS | AUX-1 | AUX-2 | AUX-3 / SPI | D11 | D6 | D5 | D4 | D47 | A9 | A11 | SCK | MISO | D32 | 5V | GND | D2 | D1 | GND | D63 | D48 | D42 | D65 | GND | D52 | D50 | 5V | 5V | 5V | 5V | 5V | GND | 5V | GND | A3 | A4 | 5V | A5 | A10 | D44 | A12 | NC | D53 | MOSI | D49 | D57 | D58 | D59 | D64 | D66 | D51 | 5V | GND | GND | GND | GND | Copyright 2011 Johnny Russell - UltiMachine
_tsilk: + | I2C | END STOPS | 21 | 1 | 20 | 1 | - | + | 1 | + | 1 | 1 | 1 | 1 | 1 | 1 | 1 | -